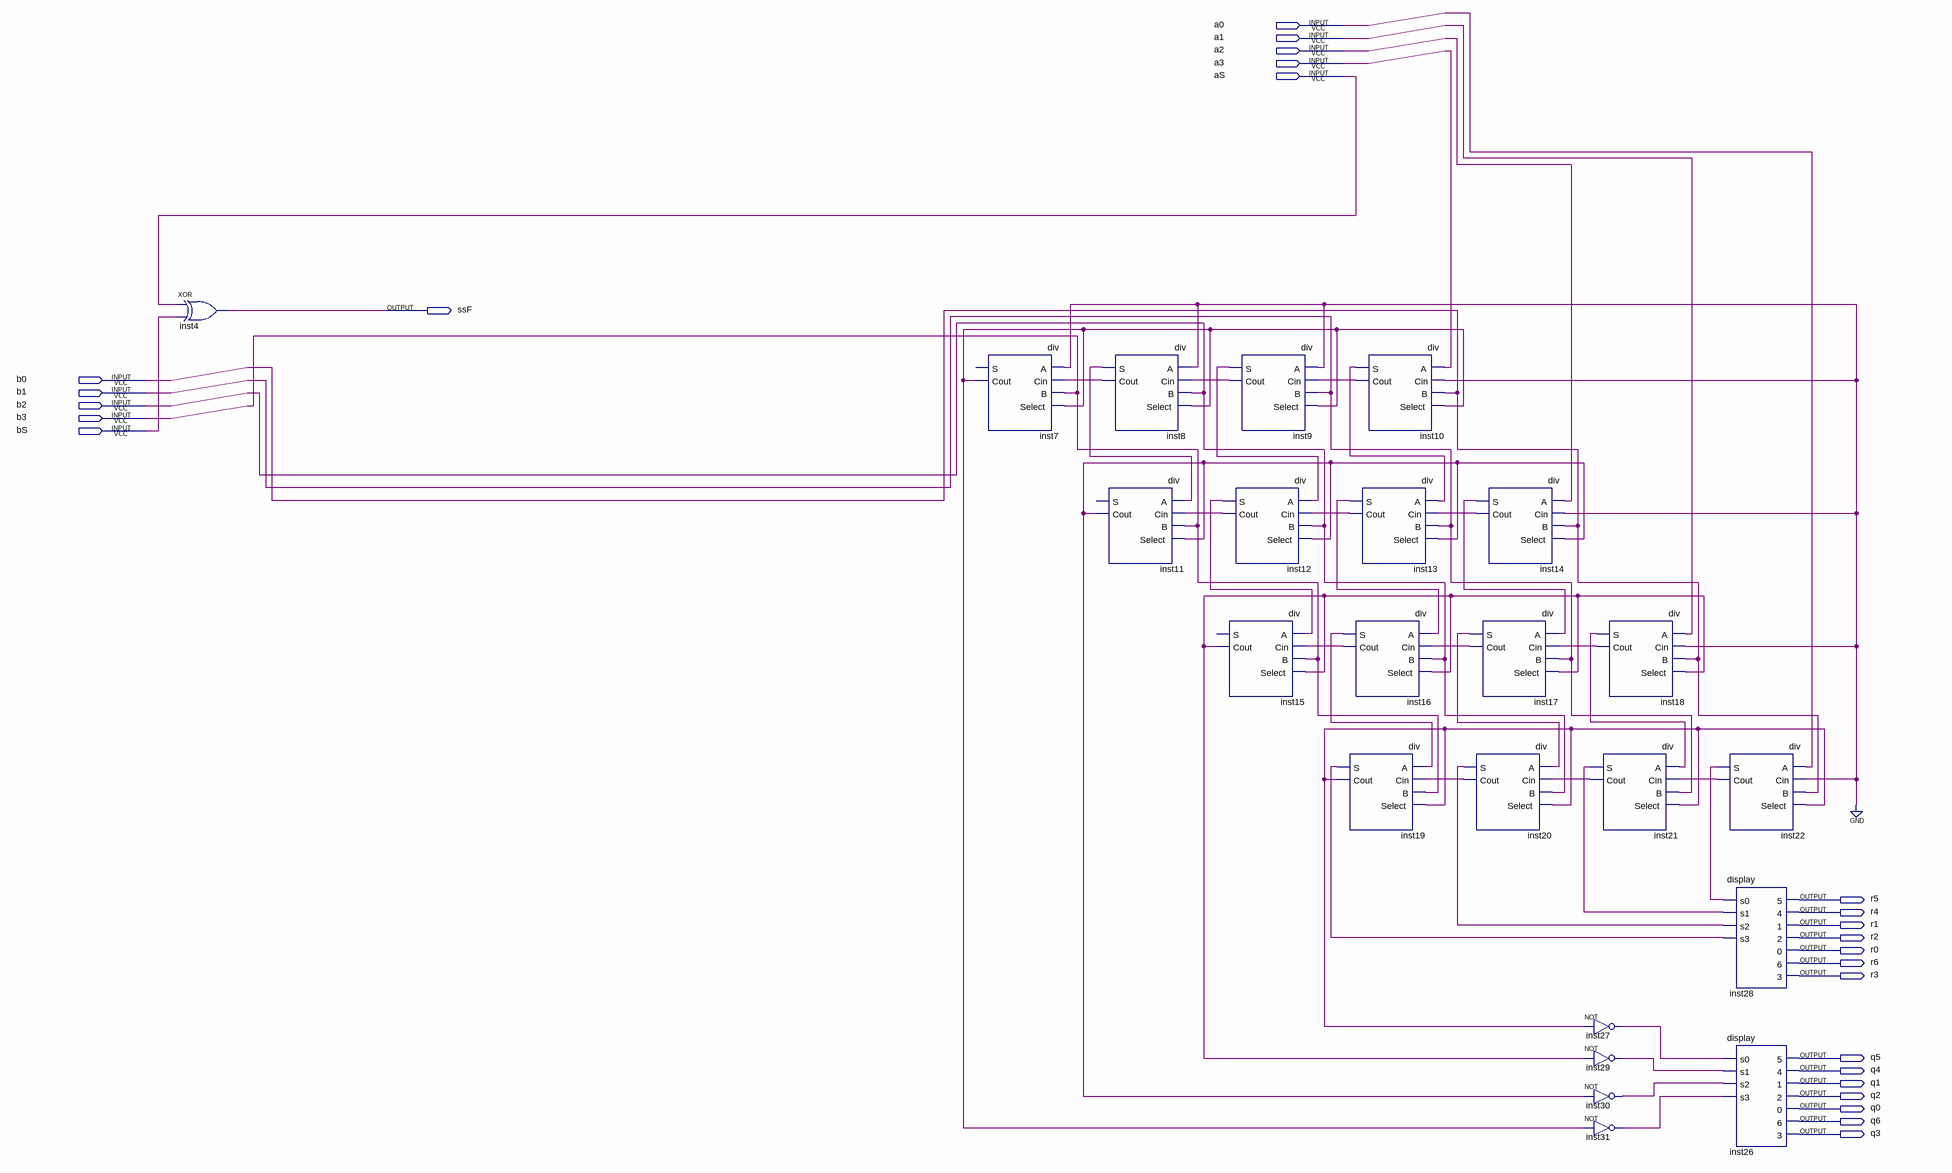
[diagram p0: schematic sheet]
// Quartus schematic divvvvv.bdf as structural Verilog: 23 symbols, 25 pins
module divvvvv (
  input  a0,
  input  a1,
  input  a2,
  input  a3,
  input  aS,
  input  b0,
  input  b1,
  input  b2,
  input  b3,
  input  bS,
  output ssF,
  output r5,
  output r4,
  output r1,
  output r2,
  output r0,
  output r6,
  output r3,
  output q5,
  output q4,
  output q1,
  output q2,
  output q0,
  output q6,
  output q3
);

  wire inst7_cout, inst8_cout, inst8_s, inst9_cout, inst9_s, inst10_cout, inst10_s, inst11_cout, inst12_cout,
       inst12_s, inst13_cout, inst13_s, inst14_cout, inst14_s, inst15_cout, inst16_cout, inst16_s,
       inst17_cout, inst17_s, inst18_cout, inst18_s, inst19_cout, inst19_s, inst20_cout, inst20_s,
       inst21_cout, inst21_s, inst22_cout, inst22_s, inst27_out, inst29_out, inst30_out, inst31_out;

  xor inst4 (ssF, aS, bS);
  div inst7 (.A(1'b0), .Cin(inst8_cout), .B(b3), .Select(inst7_cout), .Cout(inst7_cout));  // open: S
  div inst8 (.A(1'b0), .Cin(inst9_cout), .B(b2), .Select(inst7_cout), .S(inst8_s), .Cout(inst8_cout));
  div inst11 (.A(inst8_s), .Cin(inst12_cout), .B(b3), .Select(inst11_cout), .Cout(inst11_cout));  // open: S
  div inst12 (.A(inst9_s), .Cin(inst13_cout), .B(b2), .Select(inst11_cout), .S(inst12_s), .Cout(inst12_cout));
  div inst15 (.A(inst12_s), .Cin(inst16_cout), .B(b3), .Select(inst15_cout), .Cout(inst15_cout));  // open: S
  div inst9 (.A(1'b0), .Cin(inst10_cout), .B(b1), .Select(inst7_cout), .S(inst9_s), .Cout(inst9_cout));
  div inst10 (.A(a3), .Cin(1'b0), .B(b0), .Select(inst7_cout), .S(inst10_s), .Cout(inst10_cout));
  div inst13 (.A(inst10_s), .Cin(inst14_cout), .B(b1), .Select(inst11_cout), .S(inst13_s), .Cout(inst13_cout));
  div inst16 (.A(inst13_s), .Cin(inst17_cout), .B(b2), .Select(inst15_cout), .S(inst16_s), .Cout(inst16_cout));
  div inst19 (.A(inst16_s), .Cin(inst20_cout), .B(b3), .Select(inst19_cout), .S(inst19_s), .Cout(inst19_cout));
  div inst14 (.A(a2), .Cin(1'b0), .B(b0), .Select(inst11_cout), .S(inst14_s), .Cout(inst14_cout));
  div inst17 (.A(inst14_s), .Cin(inst18_cout), .B(b1), .Select(inst15_cout), .S(inst17_s), .Cout(inst17_cout));
  div inst20 (.A(inst17_s), .Cin(inst21_cout), .B(b2), .Select(inst19_cout), .S(inst20_s), .Cout(inst20_cout));
  div inst18 (.A(a1), .Cin(1'b0), .B(b0), .Select(inst15_cout), .S(inst18_s), .Cout(inst18_cout));
  div inst21 (.A(inst18_s), .Cin(inst22_cout), .B(b1), .Select(inst19_cout), .S(inst21_s), .Cout(inst21_cout));
  not inst27 (inst27_out, inst19_cout);
  not inst29 (inst29_out, inst15_cout);
  not inst30 (inst30_out, inst11_cout);
  not inst31 (inst31_out, inst7_cout);
  div inst22 (.A(a0), .Cin(1'b0), .B(b0), .Select(inst19_cout), .S(inst22_s), .Cout(inst22_cout));
  display inst28 (
    .s0(inst22_s), .s1(inst21_s), .s2(inst20_s), .s3(inst19_s), .\5 (r5), .\4 (r4), .\1 (r1), .\2 (r2),
    .\0 (r0), .\6 (r6), .\3 (r3));
  display inst26 (
    .s0(inst27_out), .s1(inst29_out), .s2(inst30_out), .s3(inst31_out), .\5 (q5), .\4 (q4), .\1 (q1),
    .\2 (q2), .\0 (q0), .\6 (q6), .\3 (q3));
endmodule
